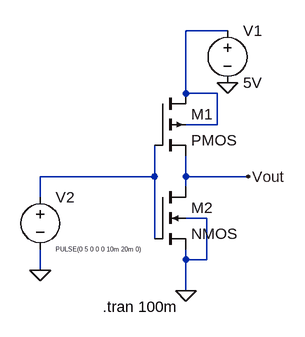
[diagram p0: schematic CMOS inverter.asc]
CMOS inverter.asc, the LTspice schematic file:
Version 4.1
SHEET 1 880 680
WIRE -32 -240 -96 -240
WIRE -96 -144 -96 -240
WIRE -48 -144 -96 -144
WIRE -48 -96 -48 -144
WIRE -48 -96 -96 -96
WIRE -144 -16 -144 -64
WIRE -144 -16 -320 -16
WIRE -96 -16 -96 -48
WIRE 0 -16 -96 -16
WIRE -96 0 -96 -16
WIRE -320 16 -320 -16
WIRE -64 48 -96 48
WIRE -144 80 -144 -16
WIRE -96 112 -96 96
WIRE -64 112 -64 48
WIRE -64 112 -96 112
WIRE -320 128 -320 96
WIRE -96 160 -96 112
FLAG -32 -160 0
FLAG -320 128 0
FLAG -96 160 0
FLAG 0 -16 Vout
SYMBOL pmos4 -144 -144 R0
SYMATTR InstName M1
SYMBOL nmos4 -144 0 R0
SYMATTR InstName M2
SYMBOL voltage -32 -256 R0
WINDOW 123 0 0 Left 0
WINDOW 39 0 0 Left 0
SYMATTR InstName V1
SYMATTR Value 5V
SYMBOL voltage -320 0 R0
WINDOW 123 0 0 Left 0
WINDOW 39 0 0 Left 0
WINDOW 3 24 96 Left 0
SYMATTR Value PULSE(0 5 0 0 0 10m 20m 0)
SYMATTR InstName V2
TEXT -224 184 Left 2 !.tran 100m

The netlist it stands for:
* CMOS inverter.asc
M1 N001 N002 Vout N001 PMOS
M2 Vout N002 0 0 NMOS
V1 N001 0 5V
V2 N002 0 PULSE(0 5 0 0 0 10m 20m 0)
.model NMOS NMOS
.model PMOS PMOS
.lib standard.mos
.tran 100m
.backanno
.end